# Altium schematic sheet [04] - IMAGE SENSORS.SchDoc
size A3; DocumentNumber: 4; SheetNumber: 4; SheetTotal: 9
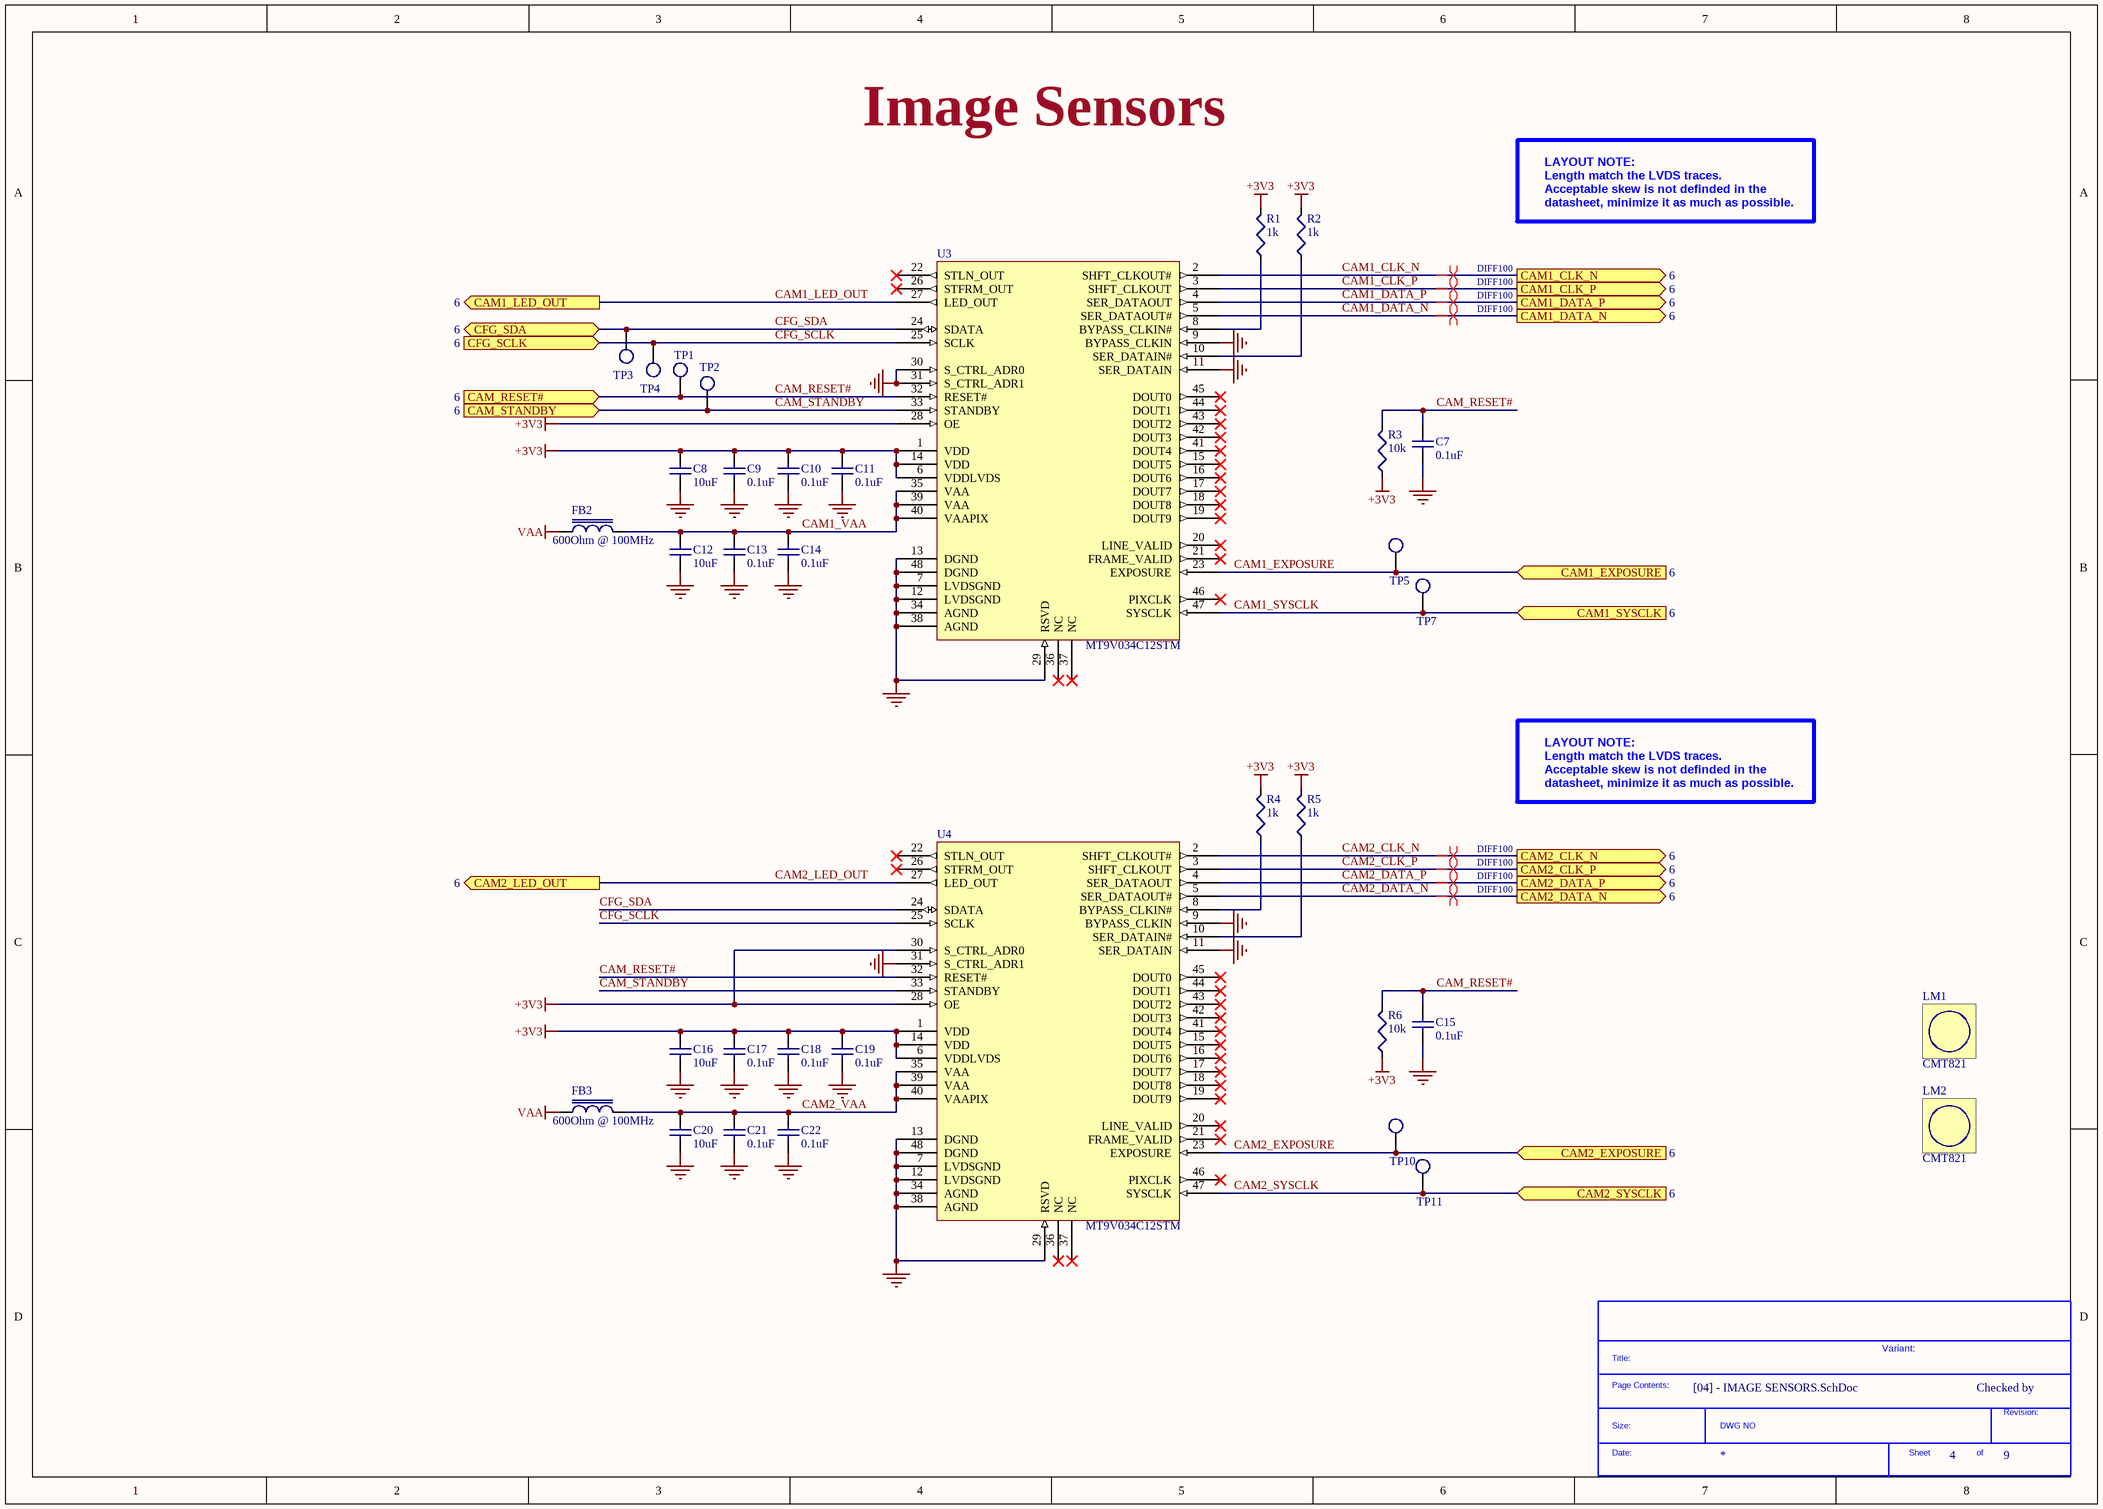
[diagram p0: [04] - IMAGE SENSORS.SchDoc]

## Parts
*  SDTitleBlock  (value not drawn)  (graphical)
C7  0.1uF  [C0603L]
C8  10uF  [C0603L]
C9  0.1uF  [C0603L]
C10  0.1uF  [C0603L]
C11  0.1uF  [C0603L]
C12  10uF  [C0603L]
C13  0.1uF  [C0603L]
C14  0.1uF  [C0603L]
C15  0.1uF  [C0603L]
C16  10uF  [C0603L]
C17  0.1uF  [C0603L]
C18  0.1uF  [C0603L]
C19  0.1uF  [C0603L]
C20  10uF  [C0603L]
C21  0.1uF  [C0603L]
C22  0.1uF  [C0603L]
FB2  600Ohm @ 100MHz  [R0603L]
FB3  600Ohm @ 100MHz  [R0603L]
LM1  CMT821  [CMT821 LENS HOLDER]  (no BOM)
LM2  CMT821  [CMT821 LENS HOLDER]  (no BOM)
R1  1k  [R0603L]
R2  1k  [R0603L]
R3  10k  [R0603L]
R4  1k  [R0603L]
R5  1k  [R0603L]
R6  10k  [R0603L]
TP1  TestPoint  [TestPoint_1.5mm]  (value not drawn)  (no BOM)
TP2  TestPoint  [TestPoint_1.5mm]  (value not drawn)  (no BOM)
TP3  TestPoint  [TestPoint_1.5mm]  (value not drawn)  (no BOM)
TP4  TestPoint  [TestPoint_1.5mm]  (value not drawn)  (no BOM)
TP5  TestPoint  [TestPoint_1.5mm]  (value not drawn)  (no BOM)
TP7  TestPoint  [TestPoint_1.5mm]  (value not drawn)  (no BOM)
TP10  TestPoint  [TestPoint_1.5mm]  (value not drawn)  (no BOM)
TP11  TestPoint  [TestPoint_1.5mm]  (value not drawn)  (no BOM)
U3  MT9V034C12STM  [LCC-48N_MT9V03X]
U4  MT9V034C12STM  [LCC-48N_MT9V03X]

## Ports
CAM1_CLK_N (out, see 6), CAM1_CLK_P (out, see 6), CAM1_DATA_N (out, see 6), CAM1_DATA_P (out, see 6), CAM1_EXPOSURE (in, see 6), CAM1_LED_OUT (out, see 6), CAM1_SYSCLK (in, see 6), CAM2_CLK_N (out, see 6), CAM2_CLK_P (out, see 6), CAM2_DATA_N (out, see 6), CAM2_DATA_P (out, see 6), CAM2_EXPOSURE (in, see 6), CAM2_LED_OUT (out, see 6), CAM2_SYSCLK (in, see 6), CAM_RESET# (in, see 6), CAM_STANDBY (in, see 6), CFG_SCLK (in, see 6), CFG_SDA (bidir, see 6)

## Nets
+3V3: C8.1 C9.1 C10.1 C11.1 C16.1 C17.1 C18.1 C19.1 R1.2 R2.2 R3.1 R4.2 R5.2 R6.1 U3.1(VDD) U3.6(VDDLVDS) U3.14(VDD) U3.28(OE) U4.1(VDD) U4.6(VDDLVDS) U4.14(VDD) U4.28(OE) U4.30(S_CTRL_ADR0)
GND: C7.2 C8.2 C9.2 C10.2 C11.2 C12.2 C13.2 C14.2 C15.2 C16.2 C17.2 C18.2 C19.2 C20.2 C21.2 C22.2 U3.7(LVDSGND) U3.9(BYPASS_CLKIN) U3.11(SER_DATAIN) U3.12(LVDSGND) U3.13(DGND) U3.29(RSVD) U3.30(S_CTRL_ADR0) U3.31(S_CTRL_ADR1) U3.34(AGND) U3.38(AGND) U3.48(DGND) U4.7(LVDSGND) U4.9(BYPASS_CLKIN) U4.11(SER_DATAIN) U4.12(LVDSGND) U4.13(DGND) U4.29(RSVD) U4.31(S_CTRL_ADR1) U4.34(AGND) U4.38(AGND) U4.48(DGND)
VAA: FB2.1 FB3.1
CAM1_CLK_N: U3.2(SHFT_CLKOUT#) ; port CAM1_CLK_N
CAM1_CLK_P: U3.3(SHFT_CLKOUT) ; port CAM1_CLK_P
CAM1_DATA_N: U3.5(SER_DATAOUT#) ; port CAM1_DATA_N
CAM1_DATA_P: U3.4(SER_DATAOUT) ; port CAM1_DATA_P
CAM1_EXPOSURE: TP5.1 U3.23(EXPOSURE) ; port CAM1_EXPOSURE
CAM1_LED_OUT: U3.27(LED_OUT) ; port CAM1_LED_OUT
CAM1_SYSCLK: TP7.1 U3.47(SYSCLK) ; port CAM1_SYSCLK
CAM1_VAA: C12.1 C13.1 C14.1 FB2.2 U3.35(VAA) U3.39(VAA) U3.40(VAAPIX)
CAM2_CLK_N: U4.2(SHFT_CLKOUT#) ; port CAM2_CLK_N
CAM2_CLK_P: U4.3(SHFT_CLKOUT) ; port CAM2_CLK_P
CAM2_DATA_N: U4.5(SER_DATAOUT#) ; port CAM2_DATA_N
CAM2_DATA_P: U4.4(SER_DATAOUT) ; port CAM2_DATA_P
CAM2_EXPOSURE: TP10.1 U4.23(EXPOSURE) ; port CAM2_EXPOSURE
CAM2_LED_OUT: U4.27(LED_OUT) ; port CAM2_LED_OUT
CAM2_SYSCLK: TP11.1 U4.47(SYSCLK) ; port CAM2_SYSCLK
CAM2_VAA: C20.1 C21.1 C22.1 FB3.2 U4.35(VAA) U4.39(VAA) U4.40(VAAPIX)
CAM_RESET#: C7.1 C15.1 R3.2 R6.2 TP1.1 U3.32(RESET#) U4.32(RESET#) ; port CAM_RESET#
CAM_STANDBY: TP2.1 U3.33(STANDBY) U4.33(STANDBY) ; port CAM_STANDBY
CFG_SCLK: TP4.1 U3.25(SCLK) U4.25(SCLK) ; port CFG_SCLK
CFG_SDA: TP3.1 U3.24(SDATA) U4.24(SDATA) ; port CFG_SDA
NetR1_1: R1.1 U3.8(BYPASS_CLKIN#)
NetR2_1: R2.1 U3.10(SER_DATAIN#)
NetR4_1: R4.1 U4.8(BYPASS_CLKIN#)
NetR5_1: R5.1 U4.10(SER_DATAIN#)

Not connected (* = marked no-connect by the designer): U3 15(DOUT5)* 16(DOUT6)* 17(DOUT7)* 18(DOUT8)* 19(DOUT9)* 20(LINE_VALID)* 21(FRAME_VALID)* 22(STLN_OUT)* 26(STFRM_OUT)* 36(NC)* 37(NC)* 41(DOUT4)* 42(DOUT3)* 43(DOUT2)* 44(DOUT1)* 45(DOUT0)* 46(PIXCLK)*; U4 15(DOUT5)* 16(DOUT6)* 17(DOUT7)* 18(DOUT8)* 19(DOUT9)* 20(LINE_VALID)* 21(FRAME_VALID)* 22(STLN_OUT)* 26(STFRM_OUT)* 36(NC)* 37(NC)* 41(DOUT4)* 42(DOUT3)* 43(DOUT2)* 44(DOUT1)* 45(DOUT0)* 46(PIXCLK)*

## Layout directives
differential pair; net class DIFF100: CAM1_CLK_N, CAM1_CLK_P, CAM1_DATA_N, CAM1_DATA_P, CAM2_CLK_N, CAM2_CLK_P, CAM2_DATA_N, CAM2_DATA_P

## Notes on the sheet
- Image Sensors
- LAYOUT NOTE:
  Length match the LVDS traces.
  Acceptable skew is not definded in the
  datasheet, minimize it as much as possible.
- CLOCKS (CPU & PCIE)
- Variant:
- Checked by
- (in symbol SDTitleBlock) Title:; Page Contents:; Revision:; Size:; DWG NO; Date:; Sheet; of

## Library data of the parts
C7 C9-C11 C13-C15 C17-C19 C21 C22 = GRM188R71H104KA93J: CAP CER 0.1UF 50V 10% X7R 0603; Manufacturer: Murata Electronics North America; Capacitance: 0.1µF; Supplier 1: Digi-Key; Manufacturer Part Number: GRM188R71H104KA93J; RoHS: RoHS Compliant; Category: Capacitors; Stock 1: 4487; Pricing 1: 1=0.12, 10=0.088, 50=0.048, 100=0.0405, 250=0.03316, 500=0.02838, 1000=0.02211, 5000=0.01843 (EUR); Packaging: Cut Tape (CT); Tolerance: ±10%; Voltage - Rated: 50V; Temperature Coefficient: X7R; Mounting Type: Surface Mount, MLCC; Operating Temperature: -55°C ~ 125°C; Applications: General Purpose; Ratings: -; Package / Case: 0603 (1608 Metric); Size / Dimension: 0.063" L x 0.031" W (1.60mm x 0.80mm); Height - Seated (Max): -; Thickness (Max): 0.035" (0.90mm); Lead Spacing: -; Features: -; Lead Style: -; ComponentLink1URL: http://www.murata.com/~/media/webrenewal/support/library/catalog/products/capacitor/mlcc/c02e.ashx; ComponentLink1Description: http://www.murata.com/~/media/webrenewal/support/library/catalog/products/capacitor/mlcc/c02e.ashx; Supplier Part Number 1: 490-9735-1-ND
C8 C12 C16 C20 = GRM188R61C106MA73D: CAP CER 10UF 16V 20% X5R 0603; Manufacturer: Murata Electronics North America; Capacitance: 10µF; Supplier 1: Digi-Key; Manufacturer Part Number: GRM188R61C106MA73D; RoHS: RoHS Compliant; Category: Capacitors; Stock 1: 1868; Pricing 1: 1=0.18, 10=0.171, 25=0.146, 50=0.1242, 100=0.1195, 250=0.10728, 500=0.10238, 1000=0.08532 (EUR); Packaging: Cut Tape (CT); Tolerance: ±20%; Voltage - Rated: 16V; Temperature Coefficient: X5R; Mounting Type: Surface Mount, MLCC; Operating Temperature: -55°C ~ 85°C; Applications: General Purpose; Ratings: -; Package / Case: 0603 (1608 Metric); Size / Dimension: 0.063" L x 0.031" W (1.60mm x 0.80mm); Height - Seated (Max): -; Thickness (Max): 0.031" (0.80mm); Lead Spacing: -; Features: -; Lead Style: -; ComponentLink1URL: http://www.murata.com/~/media/webrenewal/support/library/catalog/products/capacitor/mlcc/c02e.ashx; ComponentLink1Description: http://www.murata.com/~/media/webrenewal/support/library/catalog/products/capacitor/mlcc/c02e.ashx; Supplier Part Number 1: 490-7201-1-ND
FB2 FB3 = MPZ1608S601ATA00: FERRITE CHIP BEAD 600 OHM SMD; Manufacturer: TDK Corporation; Current Rating: 1A; DC Resistance (DCR): 150 mOhm Max; Filter Type: Differential Mode - Single; Supplier 1: Digi-Key; Manufacturer Part Number: MPZ1608S601ATA00; RoHS: RoHS Compliant; Category: Filters; Stock 1: 108962; Pricing 1: 1=0.09, 10=0.07, 100=0.0415, 250=0.0302, 500=0.02768, 1000=0.02391 (EUR); Packaging: Cut Tape (CT); Impedance @ Frequency: 600 Ohm @ 100MHz; Package / Case: 0603 (1608 Metric); Mounting Type: Surface Mount; Height (Max): 0.037" (0.95mm); Size / Dimension: 0.063" L x 0.031" W (1.60mm x 0.80mm); ComponentLink1URL: http://product.tdk.com/en/catalog/datasheets/beads_commercial_power_mpz_en.pdf; ComponentLink1Description: http://product.tdk.com/en/catalog/datasheets/beads_commercial_power_mpz_en.pdf; Supplier Part Number 1: 445-2205-1-ND
LM1 LM2 = CMT821 LENS MOUNT
R1 R2 R4 R5 = CRCW06031K00FKEA: RES SMD 1K OHM 1% 1/10W 0603; Manufacturer: Vishay Dale; Power (Watts): 0.1W, 1/10W; Temperature Coefficient: ±100ppm/°C; Supplier 1: Digi-Key; Manufacturer Part Number: CRCW06031K00FKEA; RoHS: RoHS Compliant; Category: Resistors; Stock 1: 831888; Pricing 1: 10=0.077, 50=0.0416, 200=0.02385, 1000=0.01628 (EUR); Packaging: Cut Tape (CT); Resistance (Ohms): 1k; Tolerance: ±1%; Composition: Thick Film; Features: Automotive AEC-Q200; Operating Temperature: -55°C ~ 155°C; Package / Case: 0603 (1608 Metric); Supplier Device Package: 0603 (1608 Metric); Size / Dimension: 0.061" L x 0.033" W (1.55mm x 0.85mm); Height: 0.020" (0.50mm); Number of Terminations: 2; ComponentLink1URL: http://www.vishay.com/docs/20035/dcrcwe3.pdf; ComponentLink1Description: http://www.vishay.com/docs/20035/dcrcwe3.pdf; Supplier Part Number 1: 541-1.00KHCT-ND
R3 R6 = CRCW060310K0FKEA: RES SMD 10K OHM 1% 1/10W 0603; Manufacturer: Vishay Dale; Power (Watts): 0.1W, 1/10W; Temperature Coefficient: ±100ppm/°C; Supplier 1: Digi-Key; Manufacturer Part Number: CRCW060310K0FKEA; RoHS: RoHS Compliant; Category: Resistors; Stock 1: 2971108; Pricing 1: 10=0.077, 50=0.0416, 200=0.02385, 1000=0.01628 (EUR); Packaging: Cut Tape (CT); Resistance (Ohms): 10k; Tolerance: ±1%; Composition: Thick Film; Features: Automotive AEC-Q200; Operating Temperature: -55°C ~ 155°C; Package / Case: 0603 (1608 Metric); Supplier Device Package: 0603 (1608 Metric); Size / Dimension: 0.061" L x 0.033" W (1.55mm x 0.85mm); Height: 0.020" (0.50mm); Number of Terminations: 2; ComponentLink1URL: http://www.vishay.com/docs/20035/dcrcwe3.pdf; ComponentLink1Description: http://www.vishay.com/docs/20035/dcrcwe3.pdf; Supplier Part Number 1: 541-10.0KHCT-ND
U3 U4 = MT9V034C12STM: SENSOR IMAGE VGA MONO 48-CLCC; Manufacturer: Aptina LLC; Pixel Size: 6µm x 6µm; Active Pixel Array: 752H x 480V; Frames per Second: 60; Voltage - Supply: 3.3V; Supplier 1: Digi-Key; Manufacturer Part Number: MT9V034C12STM; RoHS: RoHS Compliant; Category: Sensors, Transducers; Stock 1: 0; Pricing 1: 152=12.75178 (EUR); Packaging: Tray; Type: CMOS Imaging; Package / Case: 48-CLCC; Supplier Device Package: 48-CLCC; Note: *; ComponentLink1URL: http://media.digikey.com/pdf/Data%20Sheets/APTINA%20PDFs/MT9V034.pdf; ComponentLink1Description: http://media.digikey.com/pdf/Data%20Sheets/APTINA%20PDFs/MT9V034.pdf; Supplier Part Number 1: 557-1454-ND